# Altium schematic sheet LORA.SchDoc
size A4; SheetNumber: 3; SheetTotal: 6
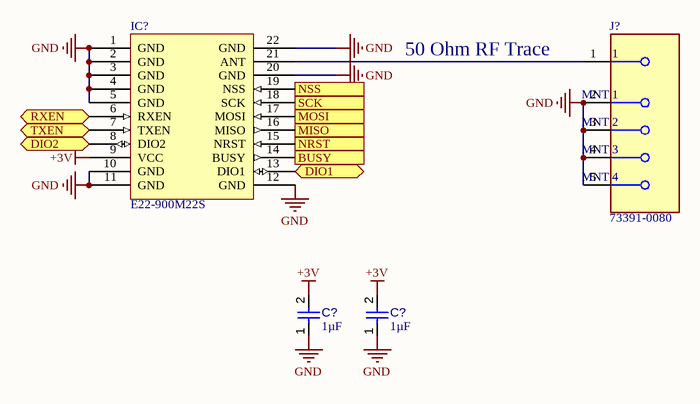
[diagram p0: LORA.SchDoc]

## Parts
(Parts that share a designator on the sheet are numbered #1, #2 ... from top to bottom, then left to right.)
C?#1  value 1µF  [CAPC2013X135X45NL10T25]  (hidden comment: Capacitor 1 uF +/- 10% 50 V 0805)
C?#2  value 1µF  [CAPC2013X135X45NL10T25]  (hidden comment: Capacitor 1 uF +/- 10% 50 V 0805)
IC?  E22-900M22S  [PE22(900M22S)]
J?  73391-0080  [FP-73391-0080-MFG]

## Ports
BUSY (out), DIO1 (bidir), DIO2 (bidir), MISO (out), MOSI (in), NRST (in), NSS (in), RXEN (bidir), SCK (in), TXEN (bidir)

## Nets
+3V: C?#1.2 C?#2.2 IC?.9(VCC)
GND: C?#1.1 C?#2.1 IC?.1(GND) IC?.2(GND) IC?.3(GND) IC?.4(GND) IC?.5(GND) IC?.10(GND) IC?.11(GND) IC?.12(GND) IC?.20(GND) IC?.22(GND) J?.2(MNT_1) J?.3(MNT_2) J?.4(MNT_3) J?.5(MNT_4)
BUSY: IC?.14(BUSY) ; port BUSY
DIO1: IC?.13(DIO1) ; port DIO1
DIO2: IC?.8(DIO2) ; port DIO2
MISO: IC?.16(MISO) ; port MISO
MOSI: IC?.17(MOSI) ; port MOSI
NRST: IC?.15(NRST) ; port NRST
NSS: IC?.19(NSS) ; port NSS
RXEN: IC?.6(RXEN) ; port RXEN
SCK: IC?.18(SCK) ; port SCK
TXEN: IC?.7(TXEN) ; port TXEN
NetIC?_21: IC?.21(ANT) J?.1

## Notes on the sheet
- 50 Ohm RF Trace

## Library data of the parts
C?#1 C?#2 = CMP-001-00007-6: Chip Capacitor, 1 uF, +/- 10%, 50 V, 0805 (2012 Metric); Capacitor Type: Ceramic; Voltage Rating: 50V; Min Operating Temperature: -55°C; RoHS Compliant: True; Mounting Technology: SM; Case/Package: 0805; Max Operating Temperature: 125°C; Tolerance: 10%; Pins: 2
J? = CMP-00257-00776539-1: 73391-0080 RF Connector, SMA RA JACK PCB 73391 SMA RF Connectors Series; Manufacturer Lifecycle Status: ACTIVE; NexarPartId: 776539; Max Frequency: 18GHz; Polarity: Standard; Impedance: 50Ω; Connector Type: Coaxial, SMA; Body Material: Zinc; Body Plating: Nickel; REACH SVHC: Unknown; Contact Plating: Gold; Radiation Hardening: No; Mount: Through Hole; Depth: 6.35mm; Length: 14.8mm; Case/Package: SMA; Lifecycle Status: Production; Contact Material: Copper; Orientation: Right Angle; Termination: Solder; Insulation Material: Teflon; Frequency: 18GHz; RoHS: Compliant; Country of Origin: TW; Halogen Free: Low Halogen; Plating: Nickel